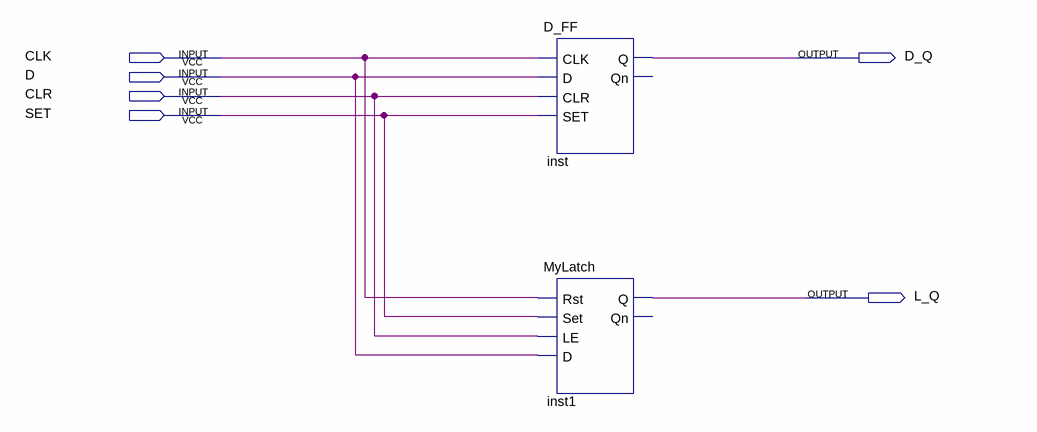
[diagram p0: schematic sheet]
// Quartus schematic DFFLATCH.bdf as structural Verilog: 2 symbols, 6 pins
module DFFLATCH (
  input  CLK,
  input  D,
  input  CLR,
  input  SET,
  output D_Q,
  output L_Q
);

  D_FF inst (.CLK(CLK), .D(D), .CLR(CLR), .SET(SET), .Q(D_Q));  // open: Qn
  MyLatch inst1 (.Rst(CLK), .Set(SET), .LE(CLR), .D(D), .Q(L_Q));  // open: Qn
endmodule
